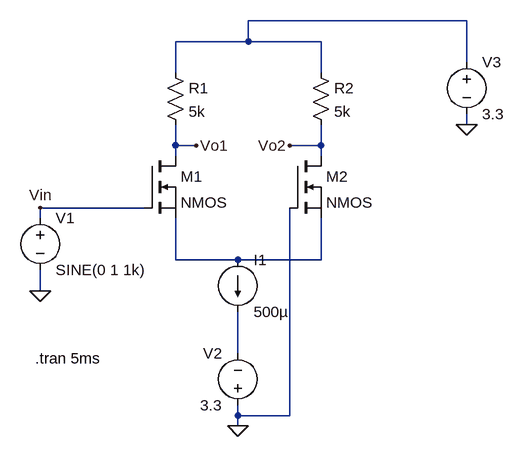
[diagram p0: schematic Differential_amplifier.asc]
Differential_amplifier.asc, the LTspice schematic file:
Version 4.1
SHEET 1 880 680
WIRE 576 -96 240 -96
WIRE 240 -64 240 -96
WIRE 240 -64 128 -64
WIRE 352 -64 240 -64
WIRE 576 -32 576 -96
WIRE 128 -16 128 -64
WIRE 352 -16 352 -64
WIRE 576 64 576 48
WIRE 128 96 128 64
WIRE 160 96 128 96
WIRE 352 96 352 64
WIRE 352 96 304 96
WIRE 128 112 128 96
WIRE 352 112 352 96
WIRE 80 192 -80 192
WIRE -80 208 -80 192
WIRE 128 272 128 208
WIRE 224 272 128 272
WIRE 352 272 352 208
WIRE 352 272 224 272
WIRE -80 320 -80 288
WIRE 224 416 224 352
WIRE 224 512 224 496
WIRE 304 512 304 192
WIRE 304 512 224 512
WIRE 224 528 224 512
FLAG -80 320 0
FLAG 576 64 0
FLAG 224 528 0
FLAG -80 192 Vin
FLAG 160 96 Vo1
FLAG 304 96 Vo2
SYMBOL nmos 80 112 R0
SYMATTR InstName M1
SYMBOL nmos 304 112 R0
SYMATTR InstName M2
SYMBOL res 112 -32 R0
SYMATTR InstName R1
SYMATTR Value 5k
SYMBOL res 336 -32 R0
SYMATTR InstName R2
SYMATTR Value 5k
SYMBOL voltage -80 192 R0
WINDOW 123 0 0 Left 0
WINDOW 39 0 0 Left 0
SYMATTR InstName V1
SYMATTR Value SINE(0 1 1k)
SYMBOL voltage 224 512 R180
WINDOW 0 24 96 Left 2
WINDOW 3 24 16 Left 2
WINDOW 123 0 0 Left 0
WINDOW 39 0 0 Left 0
SYMATTR InstName V2
SYMATTR Value 3.3
SYMBOL voltage 576 -48 R0
WINDOW 123 0 0 Left 0
WINDOW 39 0 0 Left 0
SYMATTR InstName V3
SYMATTR Value 3.3
SYMBOL current 224 272 R0
WINDOW 123 0 0 Left 0
WINDOW 39 0 0 Left 0
SYMATTR InstName I1
SYMATTR Value 500µ
TEXT -88 424 Left 2 !.tran 5ms

The netlist it stands for:
* Differential_amplifier.asc
M1 Vo1 Vin N002 N002 NMOS
M2 Vo2 0 N002 N002 NMOS
R1 N001 Vo1 5k
R2 N001 Vo2 5k
V1 Vin 0 SINE(0 1 1k)
V2 0 N003 3.3
V3 N001 0 3.3
I1 N002 N003 500µ
.model NMOS NMOS
.model PMOS PMOS
.lib standard.mos
.tran 5ms
.backanno
.end